# Altium schematic sheet sustentationAvecPC.SchDoc
size A4; Organization: ECAM; Revision: 0; SheetNumber: 1; SheetTotal: 1
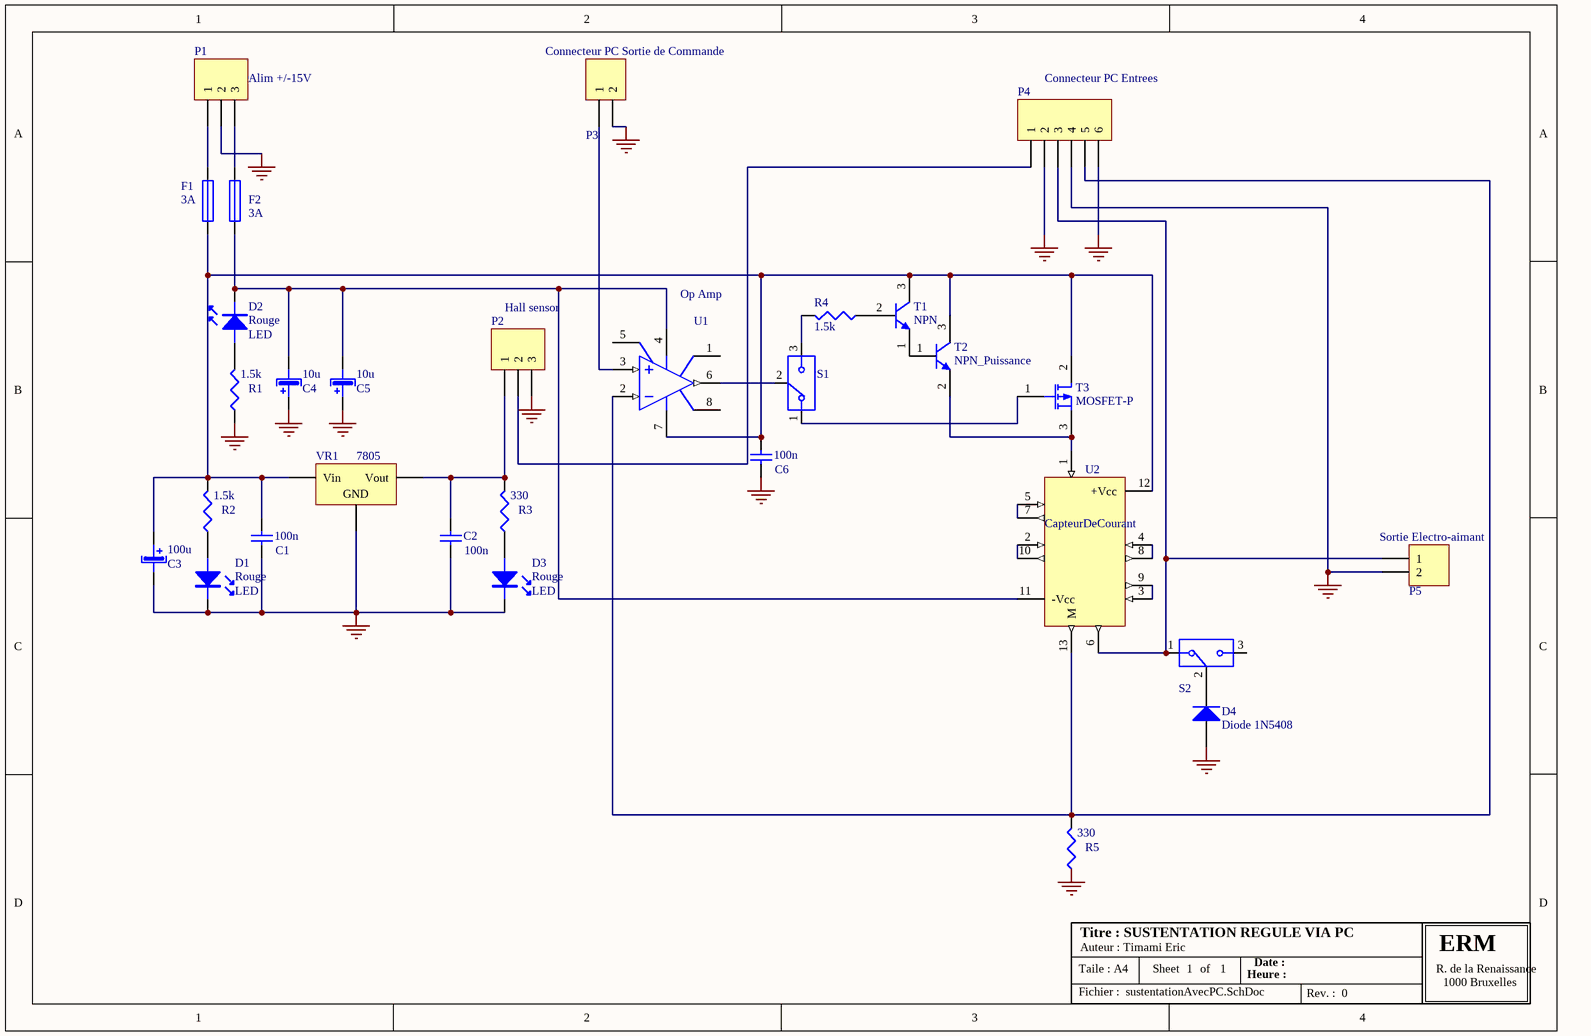
[diagram p0: sustentationAvecPC.SchDoc]

## Parts
C1  value 100n  [Capa_100n]  (hidden comment: Condensateur)
C2  value 100n  [Capa_100n]  (hidden comment: Condensateur)
C3  value 100u  [AXIAL-1.0]  (hidden comment: Cond pol radial)
C4  value 10u  [CAPPR_100u]  (hidden comment: Cond pol radial)
C5  value 10u  [CAPPR_100u]  (hidden comment: Cond pol  rad)
C6  value 100n  [Capa_100n]  (hidden comment: Condensateur)
D1  LED  Color: Rouge  [Led 0.1]
D2  LED  Color: Rouge  [Led 0.1]
D3  LED  Color: Rouge  [Led 0.1]
D4  Diode 1N5408  [DIODE-1N5408]
F1  value 3A  [FUSE-10]
F2  value 3A  [FUSE-10]
P1  Alim +/-15V  [CONVIS-3]
P2  Hall sensor  [connecteur capteur Hall]
P3  Connecteur PC Sortie de Commande  [connecteur PC Sorties command]
P4  Connecteur PC Entrees  [connecteur PC Entrées]
P5  Sortie Electro-aimant  [connecteur 3A]
R1  value 1.5k  [AXIAL-0.4]  (hidden comment: Résistance)
R2  value 1.5k  [AXIAL-0.4]  (hidden comment: Résistance)
R3  value 330  [AXIAL-0.4]  (hidden comment: Résistance)
R4  value 1.5k  [AXIAL-0.4]  (hidden comment: Résistance)
R5  value 330  [AXIAL-0.4]  (hidden comment: Résistance)
S1  DIP Inverseur  [SIP3]  (value not drawn)
S2  DIP Inverseur  [SIP3]  (value not drawn)
T1  NPN  [TO-5]
T2  NPN_Puissance  [TO-3]
T3  MOSFET-P  [TO-220 - Transistor]
U1  Op Amp  [DIP8]
U2  CapteurDeCourant  [Sonde_Courant]
VR1  7805  [TO-220 regulateur]

## Nets
GND: C1.2 C2.2 C3.2(-) C4.1(+) C5.1(+) C6.2 D1.2(K) D3.2(K) D4.1(A) P1.2 P2.3 P3.2 P4.2 P4.4 P4.6 P5.2 R1.1 VR1.2(GND)
NetC1_1: C1.1 C3.1(+) C6.1 F1.2(F2) R2.2 T1.3(C) T2.3(C) T3.2(D) U1.7(V+) U2.12(+Vcc) VR1.1(Vin)
NetC2_1: C2.1 P2.1 R3.2 VR1.3(Vout)
NetC4_2: C4.2(-) C5.2(-) D2.2(K) F2.2(F2) U1.4(V-) U2.11(-Vcc)
NetD1_1: D1.1(A) R2.1
NetD2_1: D2.1(A) R1.2
NetD3_1: D3.1(A) R3.1
NetD4_2: D4.2(K) S2.2(COM)
NetF1_1: F1.1(F1) P1.1
NetF2_1: F2.1(F1) P1.3
NetP2_2: P2.2 P4.1
NetP3_1: P3.1 U1.3(IN+)
NetP4_3: P4.3 P5.1 S2.1(TA) U2.6
NetP4_5: P4.5 R5.2 U1.2(IN-) U2.13(M)
NetR4_1: R4.1 T1.2(B)
NetR4_2: R4.2 S1.3(TB)
NetS1_1: S1.1(TA) T3.1(G)
NetS1_2: S1.2(COM) U1.6(OUT)
NetT1_1: T1.1(E) T2.1(B)
NetT2_2: T2.2(E) T3.3(S) U2.1
NetU2_2: U2.2 U2.10
NetU2_3: U2.3 U2.9
NetU2_4: U2.4 U2.8
NetU2_5: U2.5 U2.7

Not connected (* = marked no-connect by the designer): R5 1; S2 3(TB); U1 1(OS_NUL) 5(OS_NUL) 8(TAB)

## Notes on the sheet
- Taile : A4
- Titre : SUSTENTATION REGULE VIA PC
- Auteur : Timami Eric
- Sheet
- of
- Heure :
- Date :
- R. de la Renaissance
- ERM
- 1000 Bruxelles
- Fichier :
- Rev. :
- Labels drawn without touching a wire or pin: GND

## Library data of the parts
C3-C5 = Cond pol radial: Condensateur polatisé; Type: Condensateur polarisé debout; Designer: ECAM 2004
D4 = Diode 1N5408: 3 Amp Medium Power Silicon Rectifier Diode; Published: 8-Jun-2000; LatestRevisionDate: 17-Jul-2002; LatestRevisionNote: Re-released for DXP Platform.; DatasheetDocument: Aug-1984; PackageReference: DO-201AD; Publisher: Altium Limited
F1 F2 = Fusible: Designer: ECAM 2004; Type: Fusible
P1 P2 = connecteur 3: Header, 3-Pin; LatestRevisionDate: 17-Jul-2002; LatestRevisionNote: Re-released for DXP Platform.; Publisher: Altium Limited
P3 P5 = Connecteur 2: Connecteur; Designer: ECAM 2005; Type: Connecteur à vis
P4 = Header 6: Header, 6-Pin; LatestRevisionDate: 17-Jul-2002; LatestRevisionNote: Re-released for DXP Platform.; Publisher: Altium Limited
R1-R5 = Résistance: Résistance standard; Designer: ECAM 2005; Type: Résistance standard
S1 S2 = DIP Inverseur: Inverseur; Supplier: Farnell 674 345; Designer: ECAM 2003; Type: Switch slide SPDT vertical
T1 = NPN: NPN Bipolar Transistor; Published: 8-Jun-2000; LatestRevisionDate: 17-Jul-2002; LatestRevisionNote: Re-released for DXP Platform.; Publisher: Altium Limited; Code_JEDEC: TO-226-AA
T2 = NPN_Puissance: NPN Bipolar Transistor; Published: 8-Jun-2000; LatestRevisionDate: 17-Jul-2002; LatestRevisionNote: Re-released for DXP Platform.; Publisher: Altium Limited; Code_JEDEC: TO-226-AA
T3 = MOSFET-P: P-Channel MOSFET; Published: 8-Jun-2000; LatestRevisionDate: 17-Jul-2002; LatestRevisionNote: Re-released for DXP Platform.; Publisher: Altium Limited
U1 = Op Amp: FET Operational Amplifier; Published: 8-Jun-2000; LatestRevisionDate: 17-Jul-2002; LatestRevisionNote: Re-released for DXP Platform.; DatasheetDocument: REV. B; PackageReference: H-08A; Publisher: Altium Limited
VR1 = Volt Reg: Voltage Regulator; Published: 24-Mar-1999; LatestRevisionDate: 17-Jul-2002; LatestRevisionNote: Re-released for DXP Platform.; Publisher: Altium Limited; Code_JEDEC: SMD-220
C1 C2 C6 = Condensateur: Supplier: Farnell; Designer: ECAM 2004
D1-D3 = LED: Designer: ECAM 2004; Type: LED
U2 = CapteurDeCourant: Published: 8-Jun-2000; LatestRevisionDate: 17-Jul-2002; LatestRevisionNote: Re-released for DXP Platform.; DatasheetDocument: Jul-1996; PackageDocument: Jan-1998; PackageReference: D016; Publisher: Altium Limited